# Altium schematic sheet FPC-isoIOs.SchDoc
size A4; SheetNumber: 6; SheetTotal: 15
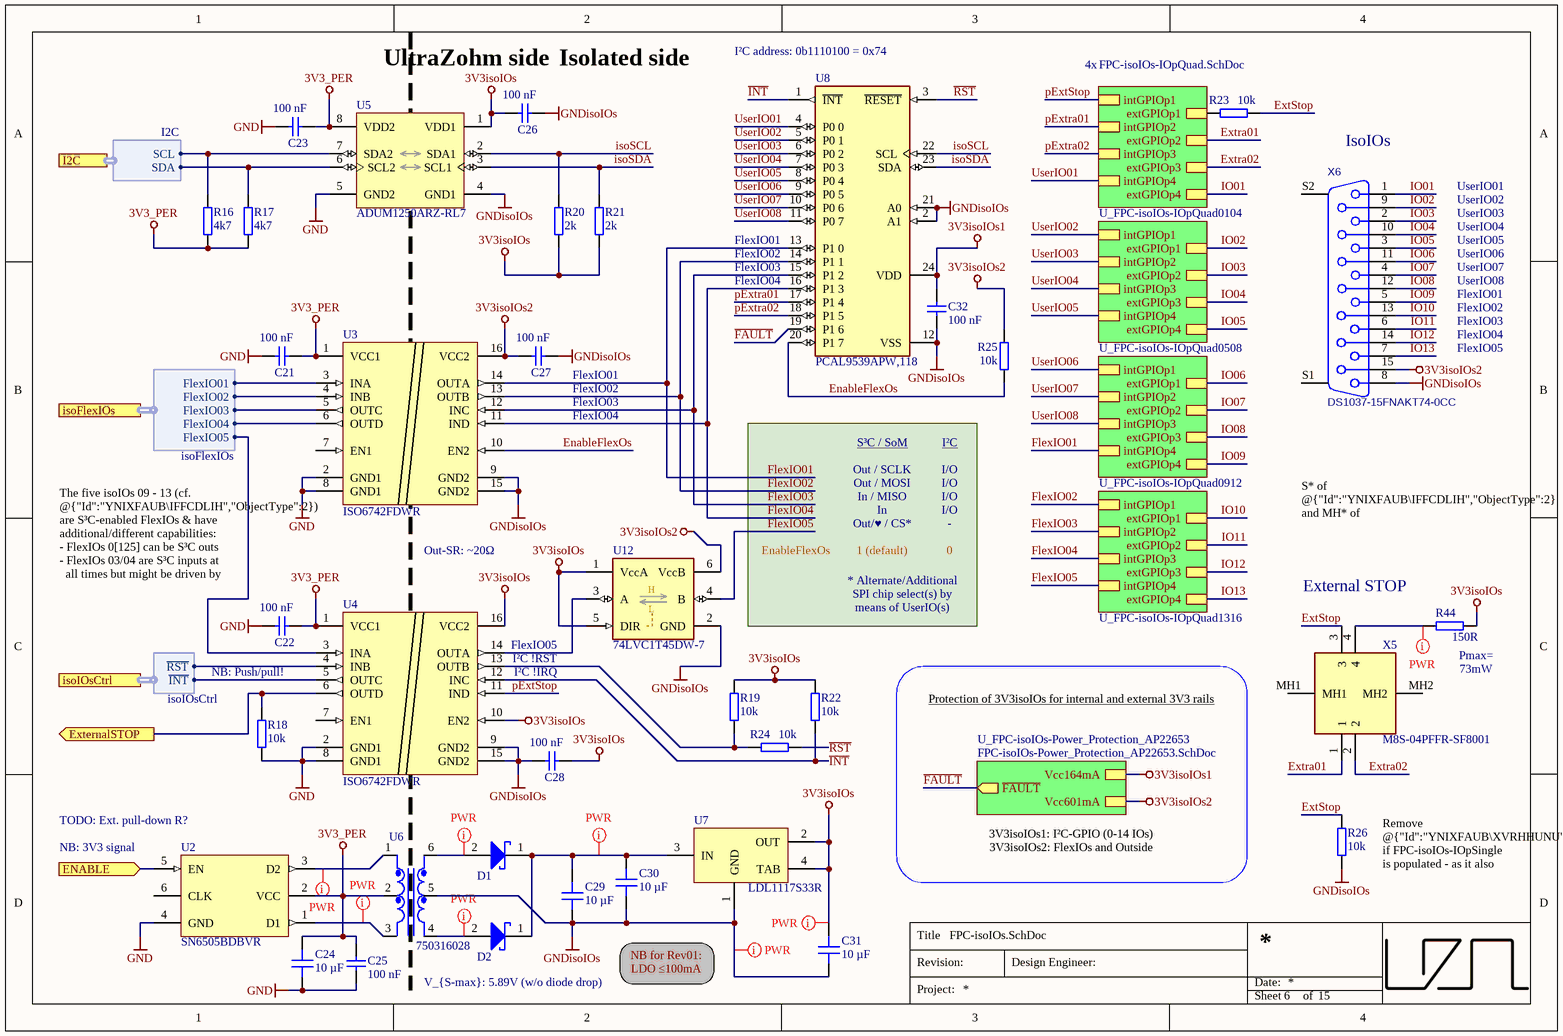
[diagram p0: FPC-isoIOs.SchDoc]

## Parts
C21  100 nF  [C_0603_TE]
C22  100 nF  [C_0603_TE]
C23  100 nF  [C_0603_TE]
C24  10 µF  [C_0603_TE]
C25  100 nF  [C_0603_TE]
C26  100 nF  [C_0603_TE]
C27  100 nF  [C_0603_TE]
C28  100 nF  [C_0603_TE]
C29  10 µF  [C_0603_TE]
C30  10 µF  [C_0603_TE]
C31  10 µF  [C_0603_TE]
C32  100 nF  [C_0603_TE]
D1  PMEG3010ER,115  [FP-SOD123W-MFG-DotOn1]  (value not drawn)
D2  PMEG3010ER,115  [FP-SOD123W-MFG-DotOn1]  (value not drawn)
R16  4k7  [R_0603_TE]
R17  4k7  [R_0603_TE]
R18  10k  [R_0603_TE]
R19  10k  [R_0603_TE]
R20  2k  [R_0603_TE]
R21  2k  [R_0603_TE]
R22  10k  [R_0603_TE]
R23  10k  [R_0603_TE]
R24  10k  [R_0603_TE]
R25  10k  [R_0603_TE]
R26  10k  [R_0603_TE]
R44  150R  [R_0603_TE]
U2  SN6505BDBVR  [TI_SOT23_6-Leads]
U3  ISO6742FDWR  [SOIC127P1030X265-16N]
U4  ISO6742FDWR  [SOIC127P1030X265-16N]
U5  ADUM1250ARZ-RL7  [ADI-R-8_N]
U6  750316028  [750316028]
U7  LDL1117S33R  [SOT230P700X170-4N]
U8  PCAL9539APW,118  [FP-SOT355-1-IPC_B]
U12  74LVC1T45DW-7  [SOT-363]
X5  M8S-04PFFR-SF8001  [M8S04PFFRSF8001]
X6  DS1037-15FNAKT74-0CC  [PCB - MISC - DSUB15]

## Sub-sheets
U_FPC-isoIOs-IOpQuad0104 = FPC-isoIOs-IOpQuad.SchDoc: intGPIOp1, intGPIOp2, intGPIOp3, intGPIOp4, extGPIOp1, extGPIOp2, extGPIOp3, extGPIOp4
U_FPC-isoIOs-IOpQuad0508 = FPC-isoIOs-IOpQuad.SchDoc: intGPIOp1, intGPIOp2, intGPIOp3, intGPIOp4, extGPIOp1, extGPIOp2, extGPIOp3, extGPIOp4
U_FPC-isoIOs-IOpQuad0912 = FPC-isoIOs-IOpQuad.SchDoc: intGPIOp1, intGPIOp2, intGPIOp3, intGPIOp4, extGPIOp1, extGPIOp2, extGPIOp3, extGPIOp4
U_FPC-isoIOs-IOpQuad1316 = FPC-isoIOs-IOpQuad.SchDoc: intGPIOp1, intGPIOp2, intGPIOp3, intGPIOp4, extGPIOp1, extGPIOp2, extGPIOp3, extGPIOp4
U_FPC-isoIOs-Power_Protection_AP22653 = FPC-isoIOs-Power_Protection_AP22653.SchDoc: ~{FAULT} (out), Vcc164mA, Vcc601mA

## Ports
ENABLE (in), ExternalSTOP (out), I2C (harness I2C), isoFlexIOs (harness isoFlexIOs), isoIOsCtrl (harness isoIOsCtrl)

## Harnesses
I2C: SCL, SDA
isoFlexIOs: FlexIO01, FlexIO02, FlexIO03, FlexIO04, FlexIO05
isoIOsCtrl: ~{RST}, ~{INT}

## Nets
3V3_PER: C21.2 C22.2 C23.2 C24.1 C25.2 R16.1 R17.1 U2.2(VCC) U3.1(VCC1) U4.1(VCC1) U5.8(VDD2) U6.2
3V3isoIOs: C26.1 C28.2 C31.2 R19.2 R20.1 R21.1 R22.2 R44.2 U4.10(EN2) U4.16(VCC2) U5.1(VDD1) U7.2(OUT) U7.4(TAB) U12.1(VccA) U12.5(DIR)
3V3isoIOs1: C32.1 U8.24(VDD) ; sheet U_FPC-isoIOs-Power_Protection_AP22653/Vcc164mA
3V3isoIOs2: C27.1 R25.2 U3.16(VCC2) U12.6(VccB) X6.15 ; sheet U_FPC-isoIOs-Power_Protection_AP22653/Vcc601mA
GND: C21.1 C22.1 C23.1 C24.2 C25.1 R18.1 U2.4(GND) U3.2(GND1) U3.8(GND1) U4.2(GND1) U4.8(GND1) U5.5(GND2)
GNDisoIOs: C26.2 C27.2 C28.1 C29.1 C30.1 C31.1 C32.2 R26.1 U3.9(GND2) U3.15(GND2) U4.9(GND2) U4.15(GND2) U5.4(GND1) U6.5 U7.1(GND) U8.2(A1) U8.12(VSS) U8.21(A0) U12.2(GND) X6.8
ENABLE: U2.5(EN) ; port ENABLE
EnableFlexOs: R25.1 U3.10(EN2) U8.20(P1_7)
ExternalSTOP: R18.2 U4.6(OUTD) ; port ExternalSTOP
Extra01: X5.1 ; sheet U_FPC-isoIOs-IOpQuad0104/extGPIOp2
Extra02: X5.2 ; sheet U_FPC-isoIOs-IOpQuad0104/extGPIOp3
ExtStop: R23.1 R26.2 X5.3
~{FAULT}: U8.19(P1_6) ; sheet U_FPC-isoIOs-Power_Protection_AP22653/~{FAULT}
FlexIO01: U3.14(OUTA) U8.13(P1_0) ; sheet U_FPC-isoIOs-IOpQuad0912/intGPIOp4
FlexIO02: U3.13(OUTB) U8.14(P1_1) ; sheet U_FPC-isoIOs-IOpQuad1316/intGPIOp1
FlexIO03: U3.12(INC) U8.15(P1_2) ; sheet U_FPC-isoIOs-IOpQuad1316/intGPIOp2
FlexIO04: U3.11(IND) U8.16(P1_3) ; sheet U_FPC-isoIOs-IOpQuad1316/intGPIOp3
FlexIO05: U12.4(B) ; sheet U_FPC-isoIOs-IOpQuad1316/intGPIOp4
~{INT}: R22.1 U4.12(INC) U8.1(~{INT})
IO01: X6.1 ; sheet U_FPC-isoIOs-IOpQuad0104/extGPIOp4
IO02: X6.9 ; sheet U_FPC-isoIOs-IOpQuad0508/extGPIOp1
IO03: X6.2 ; sheet U_FPC-isoIOs-IOpQuad0508/extGPIOp2
IO04: X6.10 ; sheet U_FPC-isoIOs-IOpQuad0508/extGPIOp3
IO05: X6.3 ; sheet U_FPC-isoIOs-IOpQuad0508/extGPIOp4
IO06: X6.11 ; sheet U_FPC-isoIOs-IOpQuad0912/extGPIOp1
IO07: X6.4 ; sheet U_FPC-isoIOs-IOpQuad0912/extGPIOp2
IO08: X6.12 ; sheet U_FPC-isoIOs-IOpQuad0912/extGPIOp3
IO09: X6.5 ; sheet U_FPC-isoIOs-IOpQuad0912/extGPIOp4
IO10: X6.13 ; sheet U_FPC-isoIOs-IOpQuad1316/extGPIOp1
IO11: X6.6 ; sheet U_FPC-isoIOs-IOpQuad1316/extGPIOp2
IO12: X6.14 ; sheet U_FPC-isoIOs-IOpQuad1316/extGPIOp3
IO13: X6.7 ; sheet U_FPC-isoIOs-IOpQuad1316/extGPIOp4
isoSCL: R20.2 U5.2(SDA1) U8.22(SCL)
isoSDA: R21.2 U5.3(SCL1) U8.23(SDA)
pExtra01: U8.17(P1_4) ; sheet U_FPC-isoIOs-IOpQuad0104/intGPIOp2
pExtra02: U8.18(P1_5) ; sheet U_FPC-isoIOs-IOpQuad0104/intGPIOp3
pExtStop: U4.11(IND) ; sheet U_FPC-isoIOs-IOpQuad0104/intGPIOp1
~{RST}: R24.1 U8.3(~{RESET})
UserIO01: U8.4(P0_0) ; sheet U_FPC-isoIOs-IOpQuad0104/intGPIOp4
UserIO02: U8.5(P0_1) ; sheet U_FPC-isoIOs-IOpQuad0508/intGPIOp1
UserIO03: U8.6(P0_2) ; sheet U_FPC-isoIOs-IOpQuad0508/intGPIOp2
UserIO04: U8.7(P0_3) ; sheet U_FPC-isoIOs-IOpQuad0508/intGPIOp3
UserIO05: U8.8(P0_4) ; sheet U_FPC-isoIOs-IOpQuad0508/intGPIOp4
UserIO06: U8.9(P0_5) ; sheet U_FPC-isoIOs-IOpQuad0912/intGPIOp1
UserIO07: U8.10(P0_6) ; sheet U_FPC-isoIOs-IOpQuad0912/intGPIOp2
UserIO08: U8.11(P0_7) ; sheet U_FPC-isoIOs-IOpQuad0912/intGPIOp3
NetC29_2: C29.2 C30.2 D1.1(K) D2.1(K) U7.3(IN)
NetD1_2: D1.2(A) U6.6
NetD2_2: D2.2(A) U6.4
NetR16_2: R16.2 U5.7(SDA2) ; port I2C.SCL
NetR17_2: R17.2 U5.6(SCL2) ; port I2C.SDA
NetR19_1: R19.1 R24.2 U4.13(OUTB)
NetR23_2: R23.2 ; sheet U_FPC-isoIOs-IOpQuad0104/extGPIOp1
NetR44_1: R44.1 X5.4
NetU2_1: U2.1(D1) U6.3
NetU2_3: U2.3(D2) U6.1
NetU3_3: U3.3(INA) ; port isoFlexIOs.FlexIO01
NetU3_4: U3.4(INB) ; port isoFlexIOs.FlexIO02
NetU3_5: U3.5(OUTC) ; port isoFlexIOs.FlexIO03
NetU3_6: U3.6(OUTD) ; port isoFlexIOs.FlexIO04
NetU4_3: U4.3(INA) ; port isoFlexIOs.FlexIO05
NetU4_4: U4.4(INB) ; port isoIOsCtrl.~{RST}
NetU4_5: U4.5(OUTC) ; port isoIOsCtrl.~{INT}
NetU4_14: U4.14(OUTA) U12.3(A)

Not connected (* = marked no-connect by the designer): U2 6(CLK); U3 7(EN1); U4 7(EN1); X5 MH1 MH2; X6 S1(MH1) S2(MH2)

## Layout directives
net class PWR: 3V3isoIOs, GNDisoIOs, NetC29_2, NetD1_2, NetD2_2, NetR44_1, NetU2_1, NetU2_3

## Notes on the sheet
- UltraZohm side
- Isolated side
- (near U8) I²C address: 0b1110100 = 0x74
- 4x
- (near X6) IsoIOs
- (near U8) FlexIO01
- UserIO01
- UserIO02
- UserIO03
- UserIO04
- UserIO05
- (near U8) FlexIO02
- (near U8) FlexIO03
- (near U8) FlexIO04
- UserIO06
- UserIO07
- UserIO08
- FlexIO01
- FlexIO02
- (near C27) FlexIO01
- FlexIO03
- FlexIO04
- FlexIO05
- (near C27) FlexIO02
- (near C27) FlexIO03
- S³C / SoM
- I²C
- Out / SCLK
- Out / MOSI
- In / MISO
- In
- I/O
- S* of @{"Id":"YNIXFAUB\IFFCDLIH","ObjectType":2} and MH* of @{"Id":"YNIXFAUB\GOGXKONJ","ObjectType":2}, as of Rev04½, are left NC to avoid GND links via the FP!
- The five isoIOs 09 - 13 (cf. @{"Id":"YNIXFAUB\IFFCDLIH","ObjectType":2}) are S³C-enabled FlexIOs & have
  additional/different capabilities:
  - FlexIOs 0[125] can be S³C outs
  - FlexIOs 03/04 are S³C inputs at
  all times but might be driven by
  @{"Id":"YNIXFAUB\EPVSWXBK","ObjectType":2} via I²C or externally (@{"Id":"YNIXFAUB\IFFCDLIH","ObjectType":2})
- Out-SR: ~20Ω
- EnableFlexOs
- Out/♥ / CS*
- 1 (default)
- -
- 0
- External STOP
- (near U4) FlexIO05
- * Alternate/Additional SPI chip select(s) by means of UserIO(s)
- NB: Push/pull!
- (near U4) I²C !RST
- (near U4) I²C !IRQ
- Protection of 3V3isoIOs for internal and external 3V3 rails
- (near R44) Pmax=
- (near R44) 73mW
- (near U2) TODO: Ext. pull-down R?
- (near U2) NB: 3V3 signal
- 3V3isoIOs1: I²C-GPIO (0-14 IOs)
- 3V3isoIOs2: FlexIOs and Outside
- (near R26) Remove @{"Id":"YNIXFAUB\XVRHHUNU","ObjectType":2}/@{"Id":"YNIXFAUB\FFMIYDHB","ObjectType":2} if FPC-isoIOs-IOpSingle is populated - as it also includes PD/S resistors
- V_{S-max}: 5.89V (w/o diode drop)
- NB for Rev01:
- LDO ≤100mA
- Title
- Revision:
- Design Engineer:
- Date:
- Project:
- Sheet
- of
- (in symbol 74LVC1T45DW-7) H; L

## Library data of the parts
C21-C23 C25-C28 C32 = UZgen_C_0603_100nF_50V_X7R: Generic capacitor; Manufacturer: UZgen; Voltage: 50V; Tolerance: 10 %; Created from: AGeiger; Manufacturer Part Number: UZgen_C_0603_100nF_50V_X7R; PartID: 1; Created On: 02/07/2024 14:42:23; Value: 100 nF; Device Package: 0603; Technology: X7R; Mounting Type: SMD; Last Updated: 08/08/2024 15:01:15
C24 C29-C31 = CL10A106MO8NQNC: Capacitor 0603, 16 VDC, 10 µF, X5R; Manufacturer: Samsung Electro-Mechanics; Tolerance: 20 %; Voltage Rating: 16 VDC; Created from: AGeiger; Manufacturer Part Number: CL10A106MO8NQNC; PartID: 101; Created On: 22/08/2022 13:56:44; ComponentLink1Description: Datasheet; ComponentLink1URL: https://datasheet.lcsc.com/lcsc/1810261909_Samsung-Electro-Mechanics-CL10A106MO8NQNC_C92487.pdf; Component Type: Capacitor 0603; Device Package: 0603; Last Updated: 19/11/2024 12:40:46; Mounting Type: SMD; Operating Temperature: -55 - 85°C; Series: X5R; Supplier 1: LCSC; Supplier Part Number 1: C92487; Type: Capacitor; Value: 10 µF; Live Cycle Status: 1; LCSC Part Number: C92487
D1 D2 = PMEG3010ER,115: Schottky Diode, 30 V, 1 A; Manufacturer: Nexperia; Value: 30V; Forward Current: 1 A; Forward Voltage: 320 mV; Reverse Current: 1.5 mA; Created from: VStarost; Manufacturer Part Number: PMEG3010ER,115; PartID: 11; Created On: 02/08/2023 09:58:23; ComponentLink1Description: Datasheet; ComponentLink1URL: https://assets.nexperia.com/documents/data-sheet/PMEG3010ER.pdf; Component Type: Schottky Diode; Device Package: SOD-123-2; Last Updated: 12/05/2025 16:46:15; Mounting Type: SMD; Operating Temperature: -55 to +150 °C; Supplier 1: Mouser; Supplier Part Number 1: 771-PMEG3010ER115; Supplier 2: LCSC; Supplier Part Number 2: C456106; Type: Schottky Diode; Live Cycle Status: 1; LCSC Part Number: C456106; Stock number: not stored; ComponentLink2Description: Homepage; ComponentLink2URL: https://www.nexperia.com/product/PMEG3010ER
R16 R17 = UZgen_R_0603_4k7: Generic resistor; Manufacturer: UZgen; Tolerance: 1 %; Created from: UZgenTool; Manufacturer Part Number: UZgen_R_0603_4k7; PartID: 237; Created On: 02/07/2024 17:29:50; Value: 4k7; Device Package: 0603; Mounting Type: SMD; Last Updated: 02/07/2024 17:29:50
R18 R19 R22-R26 = UZgen_R_0603_10k: Generic resistor; Manufacturer: UZgen; Tolerance: 1 %; Created from: AGeiger; Manufacturer Part Number: UZgen_R_0603_10k; PartID: 1; Created On: 02/07/2024 14:34:53; Value: 10k; Device Package: 0603; Mounting Type: SMD; Last Updated: 02/07/2024 14:37:16
R20 R21 = UZgen_R_0603_2k: Generic resistor; Manufacturer: UZgen; Tolerance: 1 %; Created from: UZgenTool; Manufacturer Part Number: UZgen_R_0603_2k; PartID: 228; Created On: 02/07/2024 17:29:49; Value: 2k; Device Package: 0603; Mounting Type: SMD; Last Updated: 02/07/2024 17:29:49
R44 = UZgen_R_0603_150R: Generic resistor; Manufacturer: UZgen; Tolerance: 1 %; Created from: UZgenTool; Manufacturer Part Number: UZgen_R_0603_150R; PartID: 201; Created On: 02/07/2024 17:29:49; Value: 150R; Device Package: 0603; Mounting Type: SMD; Last Updated: 02/07/2024 17:29:49
U2 = SN6505BDBVR: Low-Noise 1-A Transformer Drivers for Isolated Power Supplies; belongs to SN74AVC4T774RSVR; Manufacturer: Texas Instruments; Created from: MGremer; Manufacturer Part Number: SN6505BDBVR; PartID: 9; Created On: 30/11/2020 13:43:08; ComponentLink1Description: Datasheet; ComponentLink1URL: https://www.ti.com/lit/ds/symlink/sn6505b.pdf; Component Type: Driver Isolated Power Supplies; Device Package: SOT-23; Last Updated: 08/04/2024 08:33:03; Mounting Type: SMD; Supplier 1: Farnell; Supplier Part Number 1: 2507108; Type: Driver Isolated Power Supply; Live Cycle Status: 1; LCSC Part Number: C74518; Stock number: not stored
U3 U4 = ISO6742FDWR: Digital Isolators General-purpose, quad-channel, 2/2 digital isolator; Manufacturer: Texas Instruments; Created from: FRosner; Manufacturer Part Number: ISO6742FDWR; PartID: 5; Created On: 18/06/2024 12:17:11; ComponentLink1Description: Datasheet; ComponentLink1URL: https://www.ti.com/lit/ds/symlink/iso6742.pdf?ts=1718696457648&ref_url=https%253A%252F%252Fwww.mouser.de%252F; Component Type: Digital Isolator; Device Package: SOIC-16; Last Updated: 18/06/2024 14:14:19; Mounting Type: SMD; Operating Temperature: -40 to +125 °C; Series: ISO6742; Supplier 1: Mouser; Supplier Part Number 1: 595-ISO6742FDWR; Supplier 2: LCSC; Supplier Part Number 2: C5216408; Type: Digital Isolator; Value: ISO6742FDWR; LCSC Part Number: C5216408
U5 = ADUM1250ARZ-RL7: Digital Isolators DUAL-Hot-Swappable I²C Isolators; Manufacturer: Analog Devices Inc.; Created from: FRosner; ComponentLink1Description: Datasheet; ComponentLink1URL: https://www.mouser.de/ProductDetail/Analog-Devices/ADUM1250ARZ-RL7?qs=WIvQP4zGangN4422brPwNw%3D%3D; Manufacturer Part Number: ADUM1250ARZ-RL7; PartID: 4; Created On: 11/06/2024 20:40:52; Component Type: Digital Isolator; Device Package: SOIC-8; Last Updated: 01/04/2025 15:00:00; Mounting Type: SMD; Supplier 1: Mouser; Supplier Part Number 1: 584-ADUM1250ARZ-R7; Supplier 2: LCSC; Supplier Part Number 2: C13839; Type: Digital Isolator; Live Cycle Status: 1; LCSC Part Number: C13839; Stock number: not stored
U6 = 750316028: ⁣WE-PPTI Push-Pull Transformers; Manufacturer: Wuerth Elektronik; Created from: MGeier; Manufacturer Part Number: 750316028; PartID: 13; Created On: 03/04/2025 17:26:15; ComponentLink1Description: Datasheet; ComponentLink1URL: https://www.we-online.com/components/products/datasheet/750316028.pdf; Component Type: Push-Pull Transformer; Device Package: Divers; Last Updated: 11/04/2025 14:12:48; Mounting Type: SMD; Supplier 1: LCSC; Supplier Part Number 1: C7589037; Type: Push-Pull Transformer; Live Cycle Status: 1; Stock number: not stored; LCSC Part Number: C7589037; ComponentLink2Description: Homepage; ComponentLink2URL: https://www.we-online.com/en/components/products/WE-PPTI#750316028
U7 = LDL1117S33R: 1.2 A High PSRR low dropout linear voltage regulator, 3.3 V version; Manufacturer: STMicroelectronics; Value: 3.3 V; Created from: MGeier; Manufacturer Part Number: LDL1117S33R; PartID: 19; Created On: 11/04/2025 13:13:45; ComponentLink1Description: Datasheet; ComponentLink1URL: https://www.st.com/resource/en/datasheet/ldl1117.pdf; ComponentLink2Description: Homepage; ComponentLink2URL: https://www.st.com/en/power-management/ldl1117.html; Component Type: LDO; Device Package: SOT223; Last Updated: 11/04/2025 13:23:45; Mounting Type: SMD; Operating Temperature: -40 to +125 °C; Series: LDL1117; Supplier 1: LCSC; Supplier Part Number 1: C435835; Type: LDO; Live Cycle Status: 1; LCSC Part Number: C435835; Stock number: not stored
U8 = PCAL9539APW,118: 400kHz TSSOP-24 I/O Expanders ROHS; Manufacturer: Texas Instruments; Created from: FRosner; ComponentLink2Description: Datasheet; ComponentLink2URL: https://www.nxp.com/docs/en/data-sheet/PCAL9535A.pdf; Manufacturer Part Number: PCAL9539APW,118; PartID: 2; Created On: 18/06/2024 19:29:27; ComponentLink1Description: Datasheet; ComponentLink1URL: https://www.mouser.de/datasheet/2/302/PCAL9539A-3139236.pdf; Component Type: I²C-IO-Expander; Device Package: TSSOP-24; Last Updated: 01/04/2025 15:00:00; Mounting Type: SMD; Supplier 1: Mouser; Supplier Part Number 1: 771-PCAL9539APW118; Supplier 2: LCSC; Supplier Part Number 2: C2669720; Type: I²C IO Expander; Live Cycle Status: 1; LCSC Part Number: C2669720; Stock number: not stored
U12 = 74LVC1T45DW-7: Single-bit Dual Power Supply Translating Transceiver with 3-state Outputs; Manufacturer: Diodes Incorporated; Value: 1.65 - 5.5 V; Created from: MGeier; Manufacturer Part Number: 74LVC1T45DW-7; PartID: 13; Created On: 08/04/2025 19:00:00; ComponentLink1Description: Datasheet; ComponentLink1URL: https://www.diodes.com/datasheet/download/74LVC1T45.pdf; ComponentLink2Description: Cross Reference; ComponentLink2URL: https://www.diodes.com/assets/product-showcases/5825409.pdf#%5B%7B%22num%22%3A1%2C%22gen%22%3A0%7D%2C%7B%22name%22%3A%22Fit%22%7D%5D; ComponentLink3Description: Homepage; ComponentLink3URL: https://www.diodes.com/part/view/74LVC1T45; Component Type: Level Shifter; Device Package: SOT363; Last Updated: 08/04/2025 19:00:00; Mounting Type: SMD; Operating Temperature: –40 to +150 °C; Series: 74LVC1T45; Supplier 1: LCSC; Supplier Part Number 1: C168855; Type: Level Shifter; Live Cycle Status: 1; Stock number: not stored; LCSC Part Number: C168855
X5 = M8S-04PFFR-SF8001: Circular Metric Connectors M8 PANEL R/A PCB 4P F CONN F PIN; Manufacturer: Amphenol; Created from: FRosner; Manufacturer Part Number: M8S-04PFFR-SF8001; PartID: 9; Created On: 14/06/2024 08:06:51; ComponentLink1Description: Datasheet; ComponentLink1URL: https://www.mouser.de/datasheet/2/18/Amphenol_01132017_M8S-04PFFR-SF8001-1156555.pdf; Component Type: Amphenol LTW; Last Updated: 07/07/2024 13:38:13; Mounting Type: THT; Operating Temperature: -40 – 105 °C; Series: Amphenol LTW; Supplier 1: Mouser; Supplier Part Number 1: 523-M8S04PFFRSF8001; Supplier 2: LCSC; Supplier Part Number 2: C18212193; Type: LTW; Live Cycle Status: 1; LCSC Part Number: C18212193; Stock number: not stored
X6 = DS1037-15FNAKT74-0CC: 15 Female D-Sub Shrouded 2 3A -40℃~+85℃ Plugin D-Sub/DVI/HDMI Connectors ROHS; BOM_Manufacturer: Nextron(台湾正凌); Manufacturer: CONNFLY Elec; Contributor: LCSC; Created from: FRosner; BOM_Supplier: LCSC; BOM_Supplier Part: C2846090; BOM_Manufacturer Part: SUB-DRBF-607A-002; BOM_JLCPCB Part Class: Extended Part; spicePre: D; spiceSymbolName: SUB-DRBF-607A-002; Manufacturer Part Number: DS1037-15FNAKT74-0CC; PartID: 10; Created On: 17.03.2023 15:40:49; ComponentLink1Description: Datasheet; ComponentLink1URL: https://jlcpcb.com/partdetail/ConnflyElec-DS1037_15FNAKT740CC/C77835; Component Type: DSUB 15 pole female; Device Package: THT; Last Updated: 04.05.2023 15:17:49; Mounting Type: THT; Operating Temperature: -40℃+105℃; Supplier 1: LCSC; Supplier Part Number 1: C77835; Type: DSUB 15 pole; Live Cycle Status: 1; LCSC Part Number: C77835; Stock number: not stored